# Altium schematic sheet PSU_SET_3V3.SchDoc
size A4
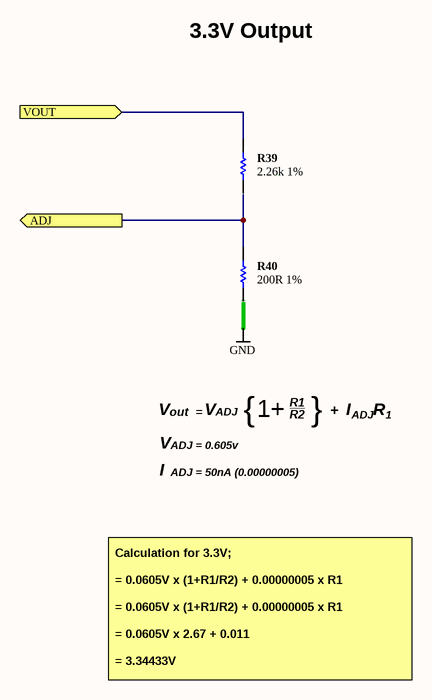
[diagram p0: PSU_SET_3V3.SchDoc]

## Parts
R39  2.26k 1%  [RESC1005-STAR]
R40  200R 1%  [RESC1005-STAR]

## Ports
ADJ (out), VOUT (in)

## Nets
GND: R40.2
ADJ: R39.1 R40.1 ; port ADJ
VOUT: R39.2 ; port VOUT

## Notes on the sheet
- 3.3V Output
- V
- out  =
- ADJ = 0.605v
- ADJ
- {
- 1+
- R1
- R2
- }
- +
- I
- R
- 1
- ADJ = 50nA (0.00000005)
- Calculation for 3.3V;
  = 0.0605V x (1+R1/R2) + 0.00000005 x R1
  = 0.0605V x (1+R1/R2) + 0.00000005 x R1
  = 0.0605V x 2.67 + 0.011
  = 3.34433V

## Library data of the parts
R39 = D-100-0126: Resistor, 120R 1% 0402 (1005); Power Rating: 63 mW; Category: Resistor; Mounting Technology: Surface Mount; Resistance: 2.26k; Status: Production; Tolerance: 1 %
R40 = D-100-0116: Resistor, 200R 1% 0402 (1005); Power Rating: 63 mW; Mounting Technology: Surface Mount; Resistance: 200 R; Status: Production; Tolerance: 1 %; Category: Resistor